# Altium schematic sheet MIC.SchDoc: Mic
size A4; Organization: Autobot Limited; Address1: 96, boulevard Bessiere; Address4: 75017 PARIS; SheetNumber: 4
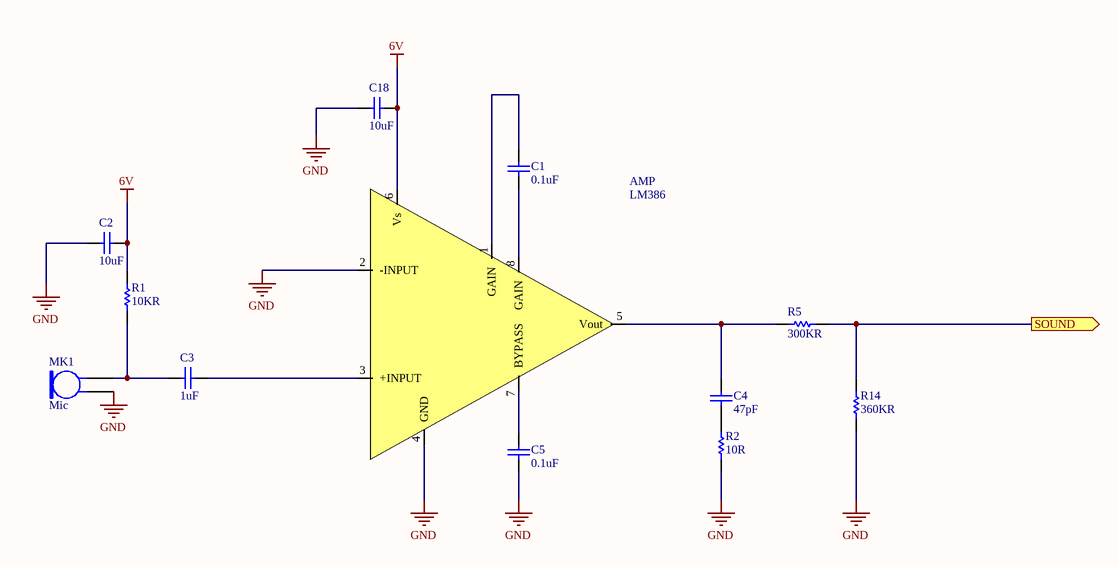
[diagram p0: MIC.SchDoc]

## Parts
AMP  LM386  [Ampli]
C1  0.1uF  [CAPC1608N]
C2  10uF  [CAPC1608N]
C3  1uF  [CAPC1608N]
C4  47pF  [CAPC1608N]
C5  0.1uF  [CAPC1608N]
C18  10uF  [CAPC1608N]
MK1  Mic  [BORNIER]
R1  10KR  [RESC1608N]
R2  10R  [RESC1608N]
R5  300KR  [RESC1608N]
R14  360KR  [RESC1608N]

## Ports
SOUND (out)

## Nets
6V: AMP.6(Vs) C2.2 C18.2 R1.1
GND: AMP.2(-INPUT) AMP.4(GND) C2.1 C5.2 C18.1 MK1.1 R2.2 R14.2
SOUND: R5.2 R14.1 ; port SOUND
NetAMP_1: AMP.1(GAIN) C1.1
NetAMP_3: AMP.3(+INPUT) C3.1
NetAMP_5: AMP.5(Vout) C4.1 R5.1
NetAMP_7: AMP.7(BYPASS) C5.1
NetAMP_8: AMP.8(GAIN) C1.2
NetC3_2: C3.2 MK1.2 R1.2
NetC4_2: C4.2 R2.1

## Notes on the sheet
- Title
- Size:
- Date:
- A4
- Number:
- Time:
- Revision:
- Sheet
- of
- File:

## Library data of the parts
AMP = LM386: RefFabricant: LM386N-1/NOPB; Fabricant: TEXAS INSTRUMENT; Fournisseur: Farnell; RefFournisseur: 2496437
C1-C5 C18 = Cap: Capacitor; Published: 8-Jun-2000; LatestRevisionDate: 17-Jul-2002; LatestRevisionNote: Re-released for DXP Platform.; PackageReference: RAD-0.3; Publisher: Altium Limited; PackageDescription: Radial Cap, Thru-Hole; 2 Leads; 0.3 in Pin Spacing
  C1 C5: Value: 0.1uF
  C2 C18: Value: 10uF
  C3: Value: 1uF
  C4: Value: 47pF
MK1 = Mic2: Microphone; Fabricant: PRO SIGNAL; Fournisseur: Farnell; RefFabricant: ABM-708-RC; RefFournisseur: 1736564; Published: 24-Mar-1999; LatestRevisionDate: 17-Jul-2002; LatestRevisionNote: Re-released for DXP Platform.; PackageReference: PIN2; Publisher: Altium Limited
R1 R2 R5 R14 = Res1: Resistor; Published: 8-Jun-2000; LatestRevisionDate: 17-Jul-2002; LatestRevisionNote: Re-released for DXP Platform.; PackageReference: AXIAL-0.3; Publisher: Altium Limited; PackageDescription: Axial Device, Thru-Hole; 2 Leads; 0.3 in Pin Spacing
  R1: Value: 10KR
  R2: Value: 10R
  R5: Value: 300KR
  R14: Value: 360KR